# Altium schematic sheet memory.SchDoc
size A
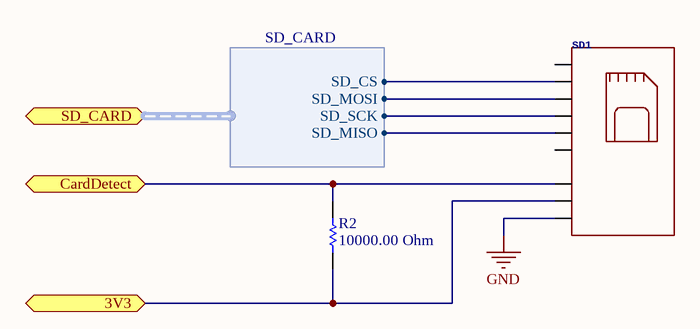
[diagram p0: memory.SchDoc]

## Parts
R2  value 10000.00 Ohm  [RESC0402(1005)_N]  (hidden comment: 2K 5% 0402(1005))
SD1  Library:  MF_Connectors Description: SD Card Connector  [MF-MICROSD]  (value not drawn)

## Ports
3V3, CardDetect, SD_CARD (harness SD_CARD)

## Harnesses
SD_CARD: SD_CS, SD_MISO, SD_MOSI, SD_SCK

## Nets
GND: SD1.G0_G1_PIN6(GND)
3V3: R2.1 SD1.PIN4(3.3V) ; port 3V3
CardDetect: R2.2 SD1.PIN9_PIN10(CRD_DTCT) ; port CardDetect
NetSD1_PIN2: SD1.PIN2(CS) ; port SD_CARD.SD_CS
NetSD1_PIN3: SD1.PIN3(DI) ; port SD_CARD.SD_MOSI
NetSD1_PIN5: SD1.PIN5(SCLK) ; port SD_CARD.SD_SCK
NetSD1_PIN7: SD1.PIN7(D0) ; port SD_CARD.SD_MISO

Not connected (* = marked no-connect by the designer): SD1 PIN1(RW) PIN8(IRQ)

## Library data of the parts
R2 = CMP-1011-00081-1: 10K 0.063W 5% 0402 (1005 Metric)  SMD; HOUSEPART: MF-RES-0402-10K; Case-EIA: 0402; Case-Metric: 1005; Power: 0.063 W; Technology: SMT; Tolerance: 5 %; Supplier 1: Digi-Key; Supplier Part Number 1: P10KJCT-ND
SD1 = SD_CARD_SLOT_MICRO_RIGHT: HOUSEPART: YES; GateName_1: G$1; POPULATE: 1; SymbolName_1: SD_CARD; DeviceName: _MICRO_RIGHT; LibraryName: MF_Connectors; DeviceSetName: SD_CARD_SLOT; MPN: MF-MICROSD; URL: https://factory.macrofab.com/part/MF-MICROSD